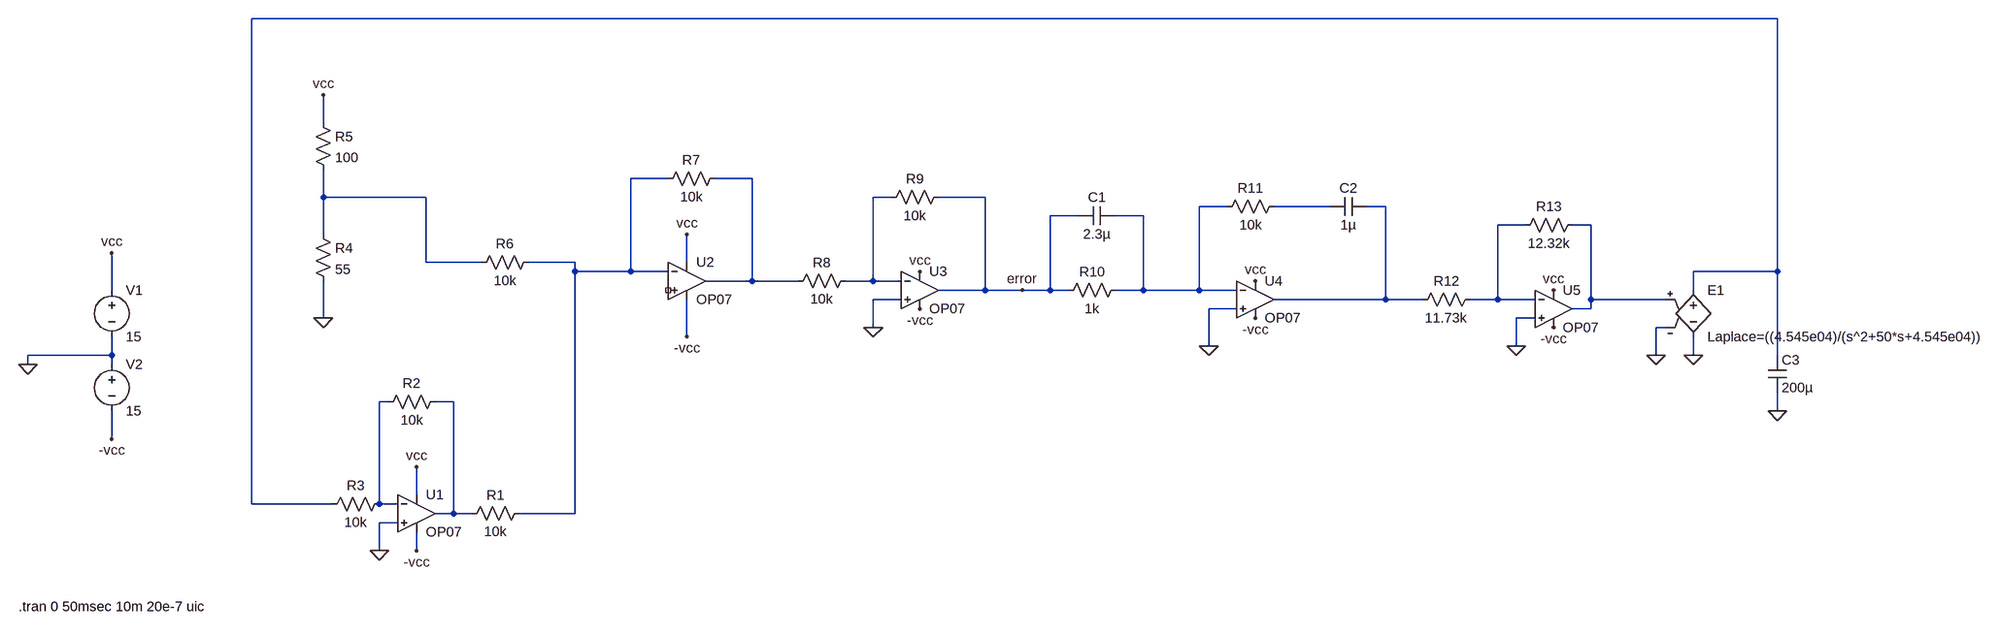
[diagram p0: schematic Jara_Ivan_PID_tfcn.asc]
Jara_Ivan_PID_tfcn.asc, the LTspice schematic file:
Version 4.1
SHEET 1 3316 680
WIRE 2896 -496 192 -496
WIRE 400 -240 400 -288
WIRE 992 -144 928 -144
WIRE 1136 -144 1072 -144
WIRE 400 -112 400 -160
WIRE 576 -112 400 -112
WIRE 1376 -112 1344 -112
WIRE 1536 -112 1456 -112
WIRE 1952 -96 1904 -96
WIRE 2128 -96 2032 -96
WIRE 2224 -96 2192 -96
WIRE 1696 -80 1648 -80
WIRE 1808 -80 1760 -80
WIRE 2464 -64 2416 -64
WIRE 2576 -64 2544 -64
WIRE 400 -48 400 -112
WIRE 576 0 576 -112
WIRE 672 0 576 0
WIRE 832 0 752 0
WIRE 1024 0 1024 -48
WIRE 832 16 832 0
WIRE 928 16 928 -144
WIRE 928 16 832 16
WIRE 992 16 928 16
WIRE 2896 16 2896 -496
WIRE 2896 16 2752 16
WIRE 1136 32 1136 -144
WIRE 1136 32 1056 32
WIRE 1216 32 1136 32
WIRE 1344 32 1344 -112
WIRE 1344 32 1296 32
WIRE 1392 32 1344 32
WIRE -48 48 -48 -16
WIRE 1536 48 1536 -112
WIRE 1536 48 1456 48
WIRE 1600 48 1536 48
WIRE 1648 48 1648 -80
WIRE 1648 48 1600 48
WIRE 1680 48 1648 48
WIRE 1808 48 1808 -80
WIRE 1808 48 1760 48
WIRE 1904 48 1904 -96
WIRE 1904 48 1808 48
WIRE 1968 48 1904 48
WIRE 2752 48 2752 16
WIRE 1392 64 1344 64
WIRE 2224 64 2224 -96
WIRE 2224 64 2032 64
WIRE 2288 64 2224 64
WIRE 2416 64 2416 -64
WIRE 2416 64 2368 64
WIRE 2480 64 2416 64
WIRE 2576 64 2576 -64
WIRE 2704 64 2576 64
WIRE 1968 80 1920 80
WIRE 2576 80 2576 64
WIRE 2576 80 2544 80
WIRE 400 96 400 32
WIRE 2480 96 2448 96
WIRE 1344 112 1344 64
WIRE 2704 112 2688 112
WIRE 1024 128 1024 64
WIRE 1920 144 1920 80
WIRE 2448 144 2448 96
WIRE -48 160 -48 128
WIRE -48 160 -192 160
WIRE 2688 160 2688 112
WIRE 2752 160 2752 128
WIRE 2896 160 2896 16
WIRE -192 176 -192 160
WIRE -48 176 -48 160
WIRE 512 240 496 240
WIRE 624 240 592 240
WIRE 2896 256 2896 224
WIRE -48 304 -48 256
WIRE 560 400 560 352
WIRE 192 416 192 -496
WIRE 416 416 192 416
WIRE 496 416 496 240
WIRE 528 416 496 416
WIRE 624 432 624 240
WIRE 624 432 592 432
WIRE 656 432 624 432
WIRE 832 432 832 16
WIRE 832 432 736 432
WIRE 528 448 496 448
WIRE 496 496 496 448
WIRE 560 496 560 464
FLAG -192 176 0
FLAG -48 -16 vcc
FLAG -48 304 -vcc
FLAG 560 352 vcc
FLAG 560 496 -vcc
FLAG 496 496 0
FLAG 400 96 0
FLAG 400 -288 vcc
FLAG 1024 -48 vcc
FLAG 1024 128 -vcc
FLAG 1344 112 0
FLAG 1600 48 error
FLAG 1920 144 0
FLAG 2448 144 0
FLAG 1424 16 vcc
FLAG 1424 80 -vcc
FLAG 2000 32 vcc
FLAG 2000 96 -vcc
FLAG 2512 48 vcc
FLAG 2512 112 -vcc
FLAG 2896 256 0
FLAG 2688 160 0
FLAG 2752 160 0
SYMBOL voltage -48 32 R0
SYMATTR InstName V1
SYMATTR Value 15
SYMBOL voltage -48 160 R0
SYMATTR InstName V2
SYMATTR Value 15
SYMBOL OpAmps\\OP07 560 368 R0
SYMATTR InstName U1
SYMBOL res 752 416 R90
WINDOW 0 0 56 VBottom 2
WINDOW 3 32 56 VTop 2
SYMATTR InstName R1
SYMATTR Value 10k
SYMBOL res 608 224 R90
WINDOW 0 0 56 VBottom 2
WINDOW 3 32 56 VTop 2
SYMATTR InstName R2
SYMATTR Value 10k
SYMBOL res 512 400 R90
WINDOW 0 0 56 VBottom 2
WINDOW 3 32 56 VTop 2
SYMATTR InstName R3
SYMATTR Value 10k
SYMBOL res 384 -64 R0
SYMATTR InstName R4
SYMATTR Value 55
SYMBOL res 384 -256 R0
SYMATTR InstName R5
SYMATTR Value 100
SYMBOL res 768 -16 R90
WINDOW 0 0 56 VBottom 2
WINDOW 3 32 56 VTop 2
SYMATTR InstName R6
SYMATTR Value 10k
SYMBOL OpAmps\\OP07 1024 -32 R0
SYMATTR InstName U2
SYMBOL res 1088 -160 R90
WINDOW 0 0 56 VBottom 2
WINDOW 3 32 56 VTop 2
SYMATTR InstName R7
SYMATTR Value 10k
SYMBOL res 1312 16 R90
WINDOW 0 0 56 VBottom 2
WINDOW 3 32 56 VTop 2
SYMATTR InstName R8
SYMATTR Value 10k
SYMBOL OpAmps\\OP07 1424 -16 R0
SYMATTR InstName U3
SYMBOL res 1472 -128 R90
WINDOW 0 0 56 VBottom 2
WINDOW 3 32 56 VTop 2
SYMATTR InstName R9
SYMATTR Value 10k
SYMBOL res 1776 32 R90
WINDOW 0 0 56 VBottom 2
WINDOW 3 32 56 VTop 2
SYMATTR InstName R10
SYMATTR Value 1k
SYMBOL cap 1760 -96 R90
WINDOW 0 0 32 VBottom 2
WINDOW 3 32 32 VTop 2
SYMATTR InstName C1
SYMATTR Value 2.3µ
SYMBOL OpAmps\\OP07 2000 0 R0
SYMATTR InstName U4
SYMBOL res 2048 -112 R90
WINDOW 0 0 56 VBottom 2
WINDOW 3 32 56 VTop 2
SYMATTR InstName R11
SYMATTR Value 10k
SYMBOL cap 2192 -112 R90
WINDOW 0 0 32 VBottom 2
WINDOW 3 32 32 VTop 2
SYMATTR InstName C2
SYMATTR Value 1µ
SYMBOL res 2384 48 R90
WINDOW 0 0 56 VBottom 2
WINDOW 3 32 56 VTop 2
SYMATTR InstName R12
SYMATTR Value 11.73k
SYMBOL OpAmps\\OP07 2512 16 R0
SYMATTR InstName U5
SYMBOL res 2560 -80 R90
WINDOW 0 0 56 VBottom 2
WINDOW 3 32 56 VTop 2
SYMATTR InstName R13
SYMATTR Value 12.32k
SYMBOL e 2752 32 R0
SYMATTR InstName E1
SYMATTR Value Laplace=((4.545e04)/(s^2+50*s+4.545e04))
SYMBOL cap 2880 160 R0
SYMATTR InstName C3
SYMATTR Value 200µ
TEXT -208 592 Left 2 !.tran 0 50msec 10m 20e-7 uic

The netlist it stands for:
* Jara_Ivan_PID_tfcn.asc
V1 vcc 0 15
V2 0 -vcc 15
X§U1 0 N011 vcc -vcc N012 LT1001  ; OP07, pins In+ In- V+ V- OUT
R1 N002 N012 10k
R2 N012 N011 10k
R3 N011 N001 10k
R4 N004 0 55
R5 vcc N004 100
R6 N002 N004 10k
X§U2 NC_01 N002 vcc -vcc N003 LT1001  ; OP07, pins In+ In- V+ V- OUT
R7 N003 N002 10k
R8 N005 N003 10k
X§U3 0 N005 vcc -vcc error LT1001  ; OP07, pins In+ In- V+ V- OUT
R9 error N005 10k
R10 N006 error 1k
C1 N006 error 2.3µ
X§U4 0 N006 vcc -vcc N008 LT1001  ; OP07, pins In+ In- V+ V- OUT
R11 N007 N006 10k
C2 N008 N007 1µ
R12 N009 N008 11.73k
X§U5 0 N009 vcc -vcc N010 LT1001  ; OP07, pins In+ In- V+ V- OUT
R13 N010 N009 12.32k
E1 N001 0 N010 0 Laplace=((4.545e04)/(s^2+50*s+4.545e04))
C3 N001 0 200µ
.tran 0 50msec 10m 20e-7 uic
.lib LTC.lib
.backanno
.end